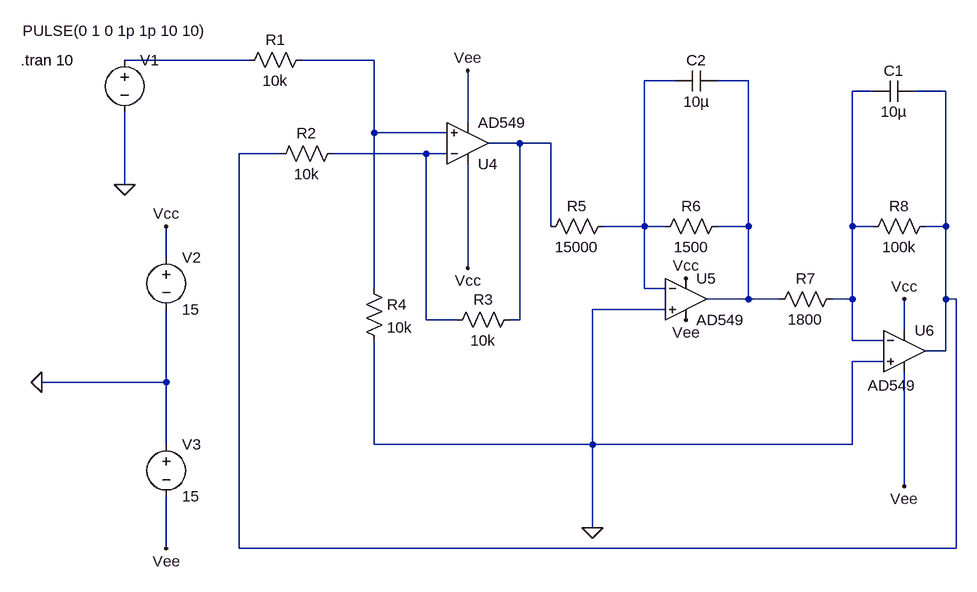
[diagram p0: schematic roteiro_6.asc]
roteiro_6.asc, the LTspice schematic file:
Version 4
SHEET 1 1200 680
WIRE -32 -320 -224 -320
WIRE 160 -320 48 -320
WIRE 624 -288 576 -288
WIRE 736 -288 688 -288
WIRE 928 -272 896 -272
WIRE 1040 -272 992 -272
WIRE 304 -224 304 -304
WIRE 160 -208 160 -320
WIRE 272 -208 160 -208
WIRE 384 -192 336 -192
WIRE 432 -192 384 -192
WIRE 16 -176 -48 -176
WIRE 240 -176 96 -176
WIRE 272 -176 240 -176
WIRE -224 -128 -224 -240
WIRE 432 -64 432 -192
WIRE 576 -64 576 -288
WIRE 576 -64 512 -64
WIRE 608 -64 576 -64
WIRE 736 -64 736 -288
WIRE 736 -64 688 -64
WIRE 896 -64 896 -272
WIRE 928 -64 896 -64
WIRE 1040 -64 1040 -272
WIRE 1040 -64 1008 -64
WIRE -160 -16 -160 -64
WIRE 304 0 304 -160
WIRE 160 32 160 -208
WIRE 576 32 576 -64
WIRE 608 32 576 32
WIRE 736 48 736 -64
WIRE 736 48 672 48
WIRE 784 48 736 48
WIRE 896 48 896 -64
WIRE 896 48 864 48
WIRE 1040 48 1040 -64
WIRE 1056 48 1040 48
WIRE 608 64 496 64
WIRE 240 80 240 -176
WIRE 288 80 240 80
WIRE 384 80 384 -192
WIRE 384 80 368 80
WIRE 976 96 976 48
WIRE 896 112 896 48
WIRE 944 112 896 112
WIRE 1040 128 1040 48
WIRE 1040 128 1008 128
WIRE 944 144 896 144
WIRE -160 176 -160 64
WIRE -160 176 -352 176
WIRE -160 272 -160 176
WIRE 160 272 160 112
WIRE 496 272 496 64
WIRE 496 272 160 272
WIRE 896 272 896 144
WIRE 896 272 496 272
WIRE 976 336 976 160
WIRE 496 400 496 272
WIRE -160 432 -160 352
WIRE -48 432 -48 -176
WIRE 1056 432 1056 48
WIRE 1056 432 -48 432
FLAG 496 400 0
FLAG -224 -128 0
FLAG -352 176 0
FLAG -160 -64 Vcc
FLAG 304 0 Vcc
FLAG 640 16 Vcc
FLAG 976 48 Vcc
FLAG -160 432 Vee
FLAG 640 80 Vee
FLAG 976 336 Vee
FLAG 304 -304 Vee
SYMBOL res 64 -336 R90
WINDOW 0 0 56 VBottom 2
WINDOW 3 32 56 VTop 2
SYMATTR InstName R1
SYMATTR Value 10k
SYMBOL res 112 -192 R90
WINDOW 0 0 56 VBottom 2
WINDOW 3 32 56 VTop 2
SYMATTR InstName R2
SYMATTR Value 10k
SYMBOL res 384 64 R90
WINDOW 0 0 56 VBottom 2
WINDOW 3 32 56 VTop 2
SYMATTR InstName R3
SYMATTR Value 10k
SYMBOL res 144 16 R0
SYMATTR InstName R4
SYMATTR Value 10k
SYMBOL res 528 -80 R90
WINDOW 0 0 56 VBottom 2
WINDOW 3 32 56 VTop 2
SYMATTR InstName R5
SYMATTR Value 15000
SYMBOL res 704 -80 R90
WINDOW 0 0 56 VBottom 2
WINDOW 3 32 56 VTop 2
SYMATTR InstName R6
SYMATTR Value 1500
SYMBOL res 880 32 R90
WINDOW 0 0 56 VBottom 2
WINDOW 3 32 56 VTop 2
SYMATTR InstName R7
SYMATTR Value 1800
SYMBOL res 1024 -80 R90
WINDOW 0 0 56 VBottom 2
WINDOW 3 32 56 VTop 2
SYMATTR InstName R8
SYMATTR Value 100k
SYMBOL cap 992 -288 R90
WINDOW 0 0 32 VBottom 2
WINDOW 3 32 32 VTop 2
SYMATTR InstName C1
SYMATTR Value 10µ
SYMBOL cap 688 -304 R90
WINDOW 0 0 32 VBottom 2
WINDOW 3 32 32 VTop 2
SYMATTR InstName C2
SYMATTR Value 10µ
SYMBOL OpAmps\\AD549 304 -128 M180
SYMATTR InstName U4
SYMBOL OpAmps\\AD549 640 -16 R0
SYMATTR InstName U5
SYMBOL OpAmps\\AD549 976 64 R0
WINDOW 3 -56 117 Left 2
SYMATTR InstName U6
SYMBOL voltage -224 -336 R0
WINDOW 123 0 0 Left 0
WINDOW 39 0 0 Left 0
WINDOW 3 -157 -29 Left 2
SYMATTR InstName V1
SYMATTR Value PULSE(0 1 0 1p 1p 10 10)
SYMBOL voltage -160 -32 R0
WINDOW 123 0 0 Left 0
WINDOW 39 0 0 Left 0
SYMATTR InstName V2
SYMATTR Value 15
SYMBOL voltage -160 256 R0
WINDOW 123 0 0 Left 0
WINDOW 39 0 0 Left 0
SYMATTR InstName V3
SYMATTR Value 15
TEXT -384 -320 Left 2 !.tran 10

The netlist it stands for:
* roteiro_6.asc
R1 N002 N001 10k
R2 N008 N006 10k
R3 N007 N008 10k
R4 N002 0 10k
R5 N003 N007 15000
R6 N004 N003 1500
R7 N005 N004 1800
R8 N006 N005 100k
C1 N006 N005 10µ
C2 N004 N003 10µ
XU4 N002 N008 Vcc Vee N007 AD549  ; pins In+ In- V+ V- OUT
XU5 0 N003 Vcc Vee N004 AD549  ; pins In+ In- V+ V- OUT
XU6 0 N005 Vcc Vee N006 AD549  ; pins In+ In- V+ V- OUT
V1 N001 0 PULSE(0 1 0 1p 1p 10 10)
V2 Vcc 0 15
V3 0 Vee 15
.tran 10
.backanno
.end